# EAGLE schematic MAIN_V093r3 (EAGLE 5.11)

## Sheet 1 of 4
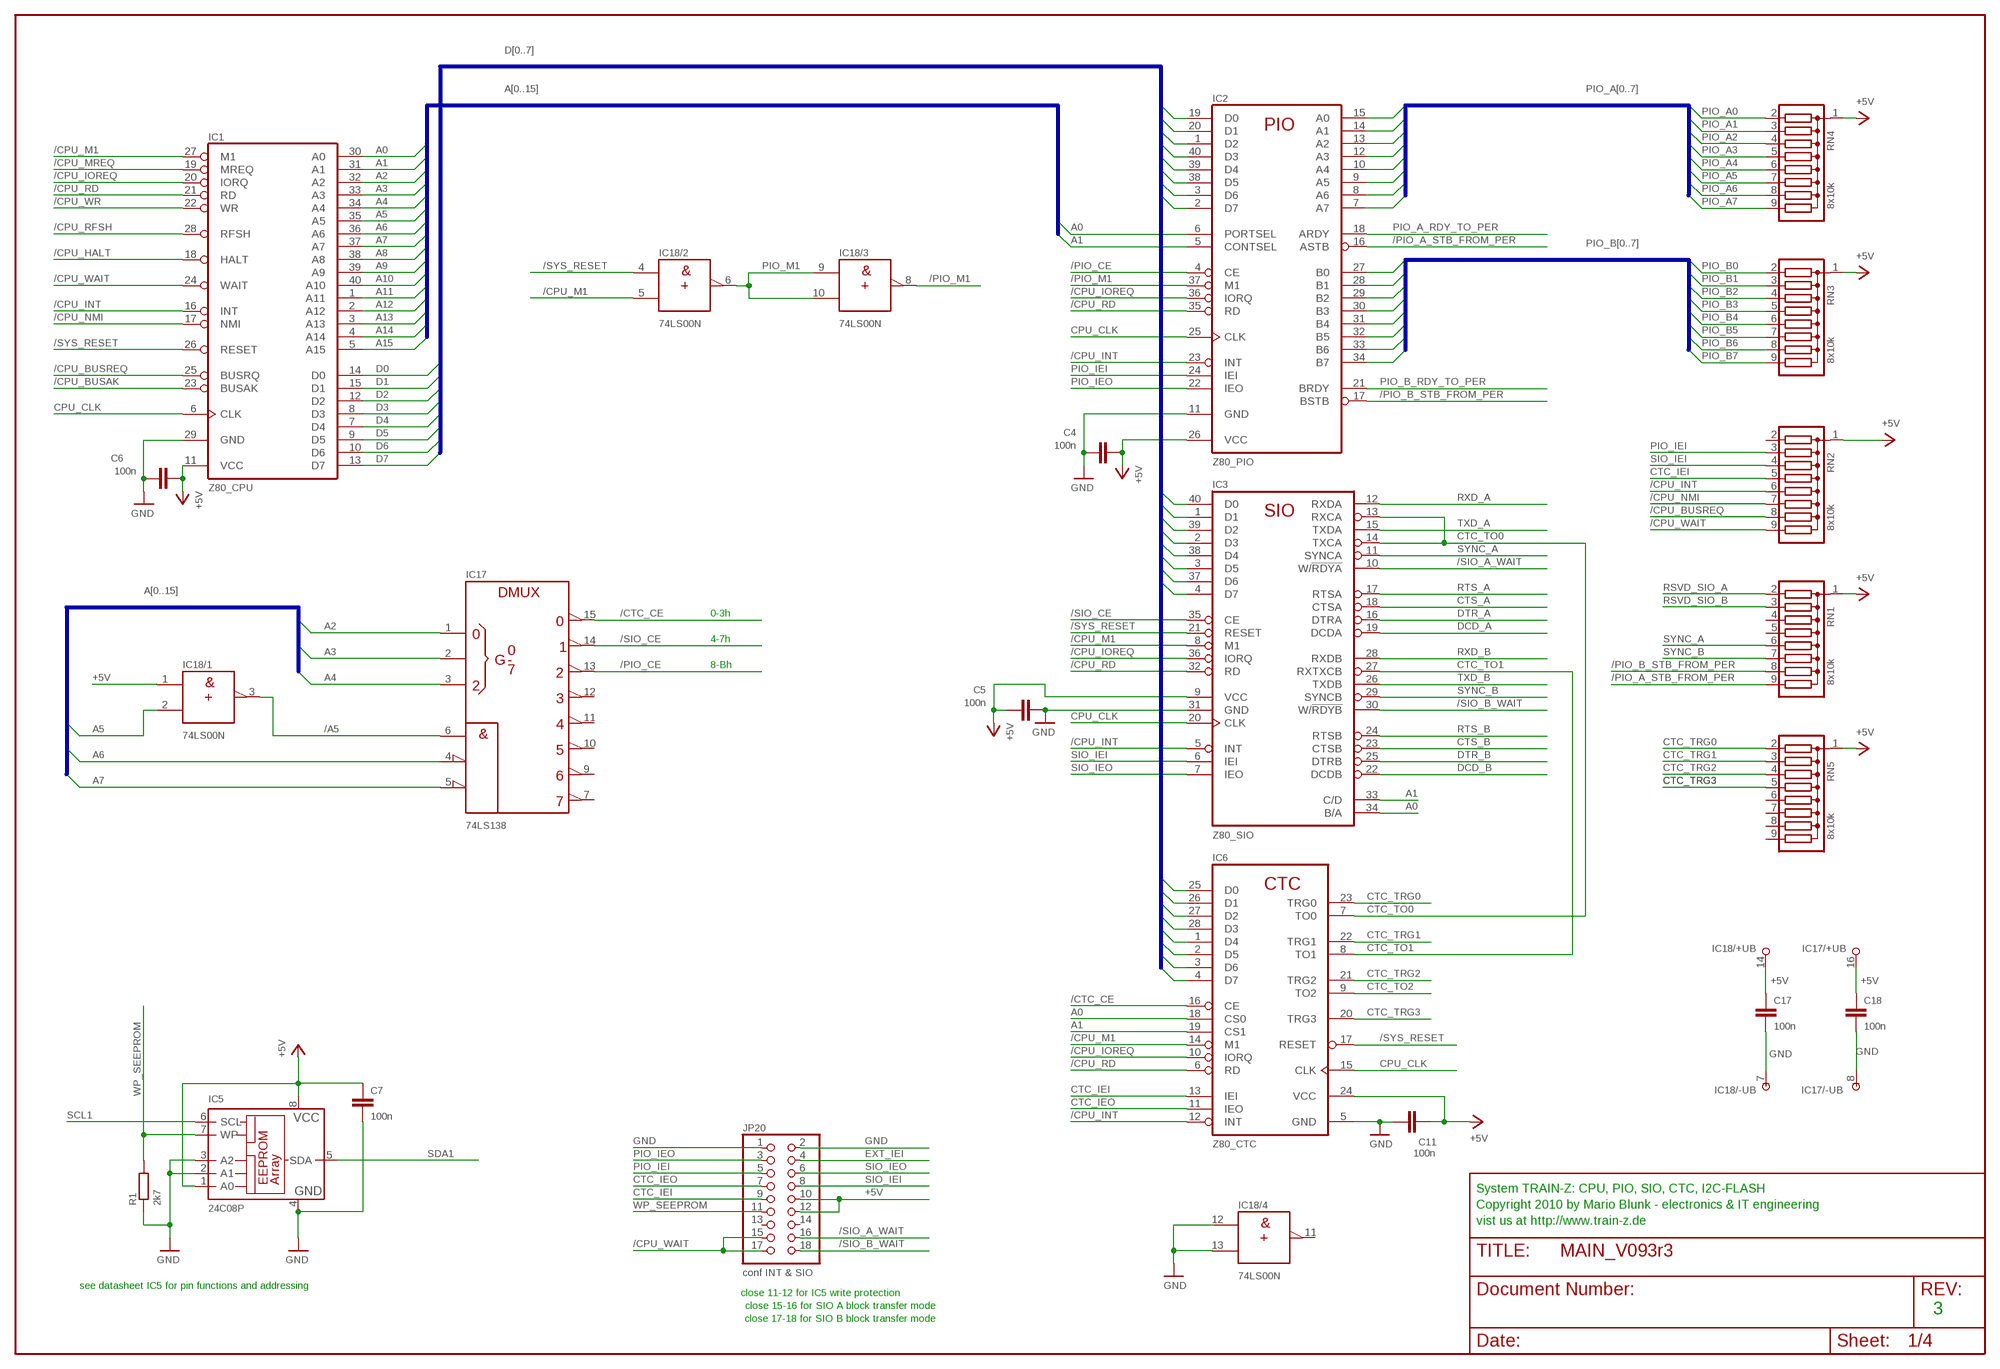
[diagram p0: schematic, sheet 1]

### Parts
C4  100n  C-EU050-030X075  [C050-030X075]
C5  100n  C-EU050-030X075  [C050-030X075]
C6  100n  C-EU050-030X075  [C050-030X075]
C7  100n  C-EU050-030X075  [C050-030X075]
C11  100n  C-EU050-030X075  [C050-030X075]
C17  100n  C-EU050-030X075  [C050-030X075]
C18  100n  C-EU050-030X075  [C050-030X075]
IC1  Z80_CPU  Z80CPU  [DIL40]
IC2  Z80_PIO  Z80PIO  [DIL40]
IC3  Z80_SIO  Z80SIO  [DIL40]
IC5  24C08P  24C64P  [DIL8]
IC6  Z80_CTC  Z80CTC  [DIL28]
IC17  74LS138  74138N  [DIL16]
IC18  74LS00N  [DIL14]
JP20  conf INT & SIO  PINHD-2X9  [2X09]
R1  2k7  R-EU_0207/10  [0207/10]
RN1  8x10k  G08R  [SIL9]
RN2  8x10k  G08R  [SIL9]
RN3  8x10k  G08R  [SIL9]
RN4  8x10k  G08R  [SIL9]
RN5  8x10k  G08R  [SIL9]

### Nets
+5V [+5V]: C4.2 C5.1 C6.2 C7.1 C11.1 C17.1 C18.1 IC1.11(VCC) IC2.26(VCC) IC3.9(VCC) IC5.1(A0) IC5.8(VCC) IC6.24(VCC) IC17.16(+UB) IC18.1(/1:A) IC18.14(/+UB:+UB) JP20.10 JP20.12 RN1.1 RN2.1 RN3.1 RN4.1 RN5.1 ; also sheet 2,3,4
/A5: IC17.6(G1) IC18.3(/1:Y)
/CPU_BUSAK: IC1.23(BUSAK) ; also sheet 2
/CPU_BUSREQ: IC1.25(BUSRQ) RN2.8 ; also sheet 2
/CPU_HALT: IC1.18(HALT) ; also sheet 2
/CPU_INT: IC1.16(INT) IC2.23(INT) IC3.5(INT) IC6.12(INT) RN2.6 ; also sheet 2
/CPU_IOREQ: IC1.20(IORQ) IC2.36(IORQ) IC3.36(IORQ) IC6.10(IORQ) ; also sheet 2
/CPU_M1: IC1.27(M1) IC3.8(M1) IC6.14(M1) IC18.5(/2:B) ; also sheet 2
/CPU_MREQ: IC1.19(MREQ) ; also sheet 2
/CPU_NMI: IC1.17(NMI) RN2.7 ; also sheet 2,4
/CPU_RD: IC1.21(RD) IC2.35(RD) IC3.32(RD) IC6.6(RD) ; also sheet 2
/CPU_RFSH: IC1.28(RFSH) ; also sheet 2
/CPU_WAIT: IC1.24(WAIT) JP20.15 JP20.17 RN2.9 ; also sheet 2
/CPU_WR: IC1.22(WR) ; also sheet 2
/CTC_CE: IC6.16(CE) IC17.15(Y0)
/PIO_A_STB_FROM_PER: IC2.16(ASTB) RN1.9 ; also sheet 2
/PIO_B_STB_FROM_PER: IC2.17(BSTB) RN1.8 ; also sheet 2
/PIO_CE: IC2.4(CE) IC17.13(Y2)
/PIO_M1: IC2.37(M1) IC18.8(/3:Y)
/SIO_A_WAIT: IC3.10(W/!RDYA) JP20.16
/SIO_B_WAIT: IC3.30(W/!RDYB) JP20.18
/SIO_CE: IC3.35(CE) IC17.14(Y1)
/SYS_RESET: IC1.26(RESET) IC3.21(RESET) IC6.17(RESET) IC18.4(/2:A) ; also sheet 2,4
A0: IC1.30(A0) IC2.6(PORTSEL) IC3.34(B/A) IC6.18(CS0) ; also sheet 2
A1: IC1.31(A1) IC2.5(CONTSEL) IC3.33(C/D) IC6.19(CS1) ; also sheet 2
A2: IC1.32(A2) IC17.1(A) ; also sheet 2
A3: IC1.33(A3) IC17.2(B) ; also sheet 2
A4: IC1.34(A4) IC17.3(C) ; also sheet 2
A5: IC1.35(A5) IC18.2(/1:B) ; also sheet 2
A6: IC1.36(A6) IC17.4(!G2A) ; also sheet 2
A7: IC1.37(A7) IC17.5(!G2B) ; also sheet 2
A8: IC1.38(A8) ; also sheet 2
A9: IC1.39(A9) ; also sheet 2
A10: IC1.40(A10) ; also sheet 2
A11: IC1.1(A11) ; also sheet 2
A12: IC1.2(A12) ; also sheet 2
A13: IC1.3(A13) ; also sheet 2
A14: IC1.4(A14) ; also sheet 2
A15: IC1.5(A15) ; also sheet 2
CPU_CLK: IC1.6(CLK) IC2.25(CLK) IC3.20(CLK) IC6.15(CLK) ; also sheet 2
CTC_IEI: IC6.13(IEI) JP20.9 RN2.5
CTC_IEO: IC6.11(IEO) JP20.7
CTC_TO0: IC3.13(RXCA) IC3.14(TXCA) IC6.7(TO0) ; also sheet 2
CTC_TO1: IC3.27(RXTXCB) IC6.8(TO1) ; also sheet 2
CTC_TO2: IC6.9(TO2) ; also sheet 2
CTC_TRG0: IC6.23(TRG0) RN5.2 ; also sheet 2
CTC_TRG1: IC6.22(TRG1) RN5.3 ; also sheet 2
CTC_TRG2: IC6.21(TRG2) RN5.4 ; also sheet 2
CTC_TRG3: IC6.20(TRG3) RN5.5 ; also sheet 2
CTS_A: IC3.18(CTSA) ; also sheet 3
CTS_B: IC3.23(CTSB) ; also sheet 3
D0: IC1.14(D0) IC2.19(D0) IC3.40(D0) IC6.25(D0) ; also sheet 2
D1: IC1.15(D1) IC2.20(D1) IC3.1(D1) IC6.26(D1) ; also sheet 2
D2: IC1.12(D2) IC2.1(D2) IC3.39(D2) IC6.27(D2) ; also sheet 2
D3: IC1.8(D3) IC2.40(D3) IC3.2(D3) IC6.28(D3) ; also sheet 2
D4: IC1.7(D4) IC2.39(D4) IC3.38(D4) IC6.1(D4) ; also sheet 2
D5: IC1.9(D5) IC2.38(D5) IC3.3(D5) IC6.2(D5) ; also sheet 2
D6: IC1.10(D6) IC2.3(D6) IC3.37(D6) IC6.3(D6) ; also sheet 2
D7: IC1.13(D7) IC2.2(D7) IC3.4(D7) IC6.4(D7) ; also sheet 2
DCD_A: IC3.19(DCDA) ; also sheet 3
DCD_B: IC3.22(DCDB) ; also sheet 3
DTR_A: IC3.16(DTRA) ; also sheet 3
DTR_B: IC3.25(DTRB) ; also sheet 3
EXT_IEI: JP20.4 ; also sheet 2
GND [GND]: C4.1 C5.2 C6.1 C7.2 C11.2 C17.2 C18.2 IC1.29(GND) IC2.11(GND) IC3.31(GND) IC5.2(A1) IC5.3(A2) IC5.4(GND) IC6.5(GND) IC17.8(-UB) IC18.7(/-UB:-UB) IC18.12(/4:A) IC18.13(/4:B) JP20.1 JP20.2 R1.1 ; also sheet 2,3,4
PIO_A0: IC2.15(A0) RN4.2 ; also sheet 2,4
PIO_A1: IC2.14(A1) RN4.3 ; also sheet 2,4
PIO_A2: IC2.13(A2) RN4.4 ; also sheet 2
PIO_A3: IC2.12(A3) RN4.5 ; also sheet 2
PIO_A4: IC2.10(A4) RN4.6 ; also sheet 2
PIO_A5: IC2.9(A5) RN4.7 ; also sheet 2
PIO_A6: IC2.8(A6) RN4.8 ; also sheet 2
PIO_A7: IC2.7(A7) RN4.9 ; also sheet 2
PIO_A_RDY_TO_PER: IC2.18(ARDY) ; also sheet 2
PIO_B0: IC2.27(B0) RN3.2 ; also sheet 4
PIO_B1: IC2.28(B1) RN3.3 ; also sheet 4
PIO_B2: IC2.29(B2) RN3.4 ; also sheet 2,4
PIO_B3: IC2.30(B3) RN3.5 ; also sheet 2,4
PIO_B4: IC2.31(B4) RN3.6 ; also sheet 2,3
PIO_B5: IC2.32(B5) RN3.7 ; also sheet 2,3
PIO_B6: IC2.33(B6) RN3.8 ; also sheet 2
PIO_B7: IC2.34(B7) RN3.9 ; also sheet 2
PIO_B_RDY_TO_PER: IC2.21(BRDY) ; also sheet 2
PIO_IEI: IC2.24(IEI) JP20.5 RN2.3
PIO_IEO: IC2.22(IEO) JP20.3
PIO_M1: IC18.6(/2:Y) IC18.9(/3:A) IC18.10(/3:B)
RSVD_SIO_A: RN1.2 ; also sheet 3
RSVD_SIO_B: RN1.3 ; also sheet 3
RTS_A: IC3.17(RTSA) ; also sheet 3
RTS_B: IC3.24(RTSB) ; also sheet 3
RXD_A: IC3.12(RXDA) ; also sheet 3
RXD_B: IC3.28(RXDB) ; also sheet 3
SCL1: IC5.6(SCL) ; also sheet 4
SDA1: IC5.5(SDA) ; also sheet 4
SIO_IEI: IC3.6(IEI) JP20.8 RN2.4
SIO_IEO: IC3.7(IEO) JP20.6
SYNC_A: IC3.11(SYNCA) RN1.6
SYNC_B: IC3.29(SYNCB) RN1.7
TXD_A: IC3.15(TXDA) ; also sheet 3
TXD_B: IC3.26(TXDB) ; also sheet 3
WP_SEEPROM: IC5.7(WP) JP20.11 R1.2
Unconnected: IC17.7(Y7) IC17.9(Y6) IC17.10(Y5) IC17.11(Y4) IC17.12(Y3) IC18.11(/4:Y) JP20.13 JP20.14 RN1.4 RN1.5 RN2.2 RN5.6 RN5.7 RN5.8 RN5.9

### Buses
A[0..15]
D[0..7]
PIO_B[0..7]
PIO_A[0..7]

### Notes on the sheet
- 0-3h
- 4-7h
- 8-Bh
- System TRAIN-Z: CPU, PIO, SIO, CTC, I2C-FLASH
- Copyright 2010 by Mario Blunk - electronics & IT engineering
- vist us at http://www.train-z.de
- see datasheet IC5 for pin functions and addressing | close 11-12 for IC5 write protection
- close 15-16 for SIO A block transfer mode
- close 17-18 for SIO B block transfer mode | 3

## Sheet 2 of 4
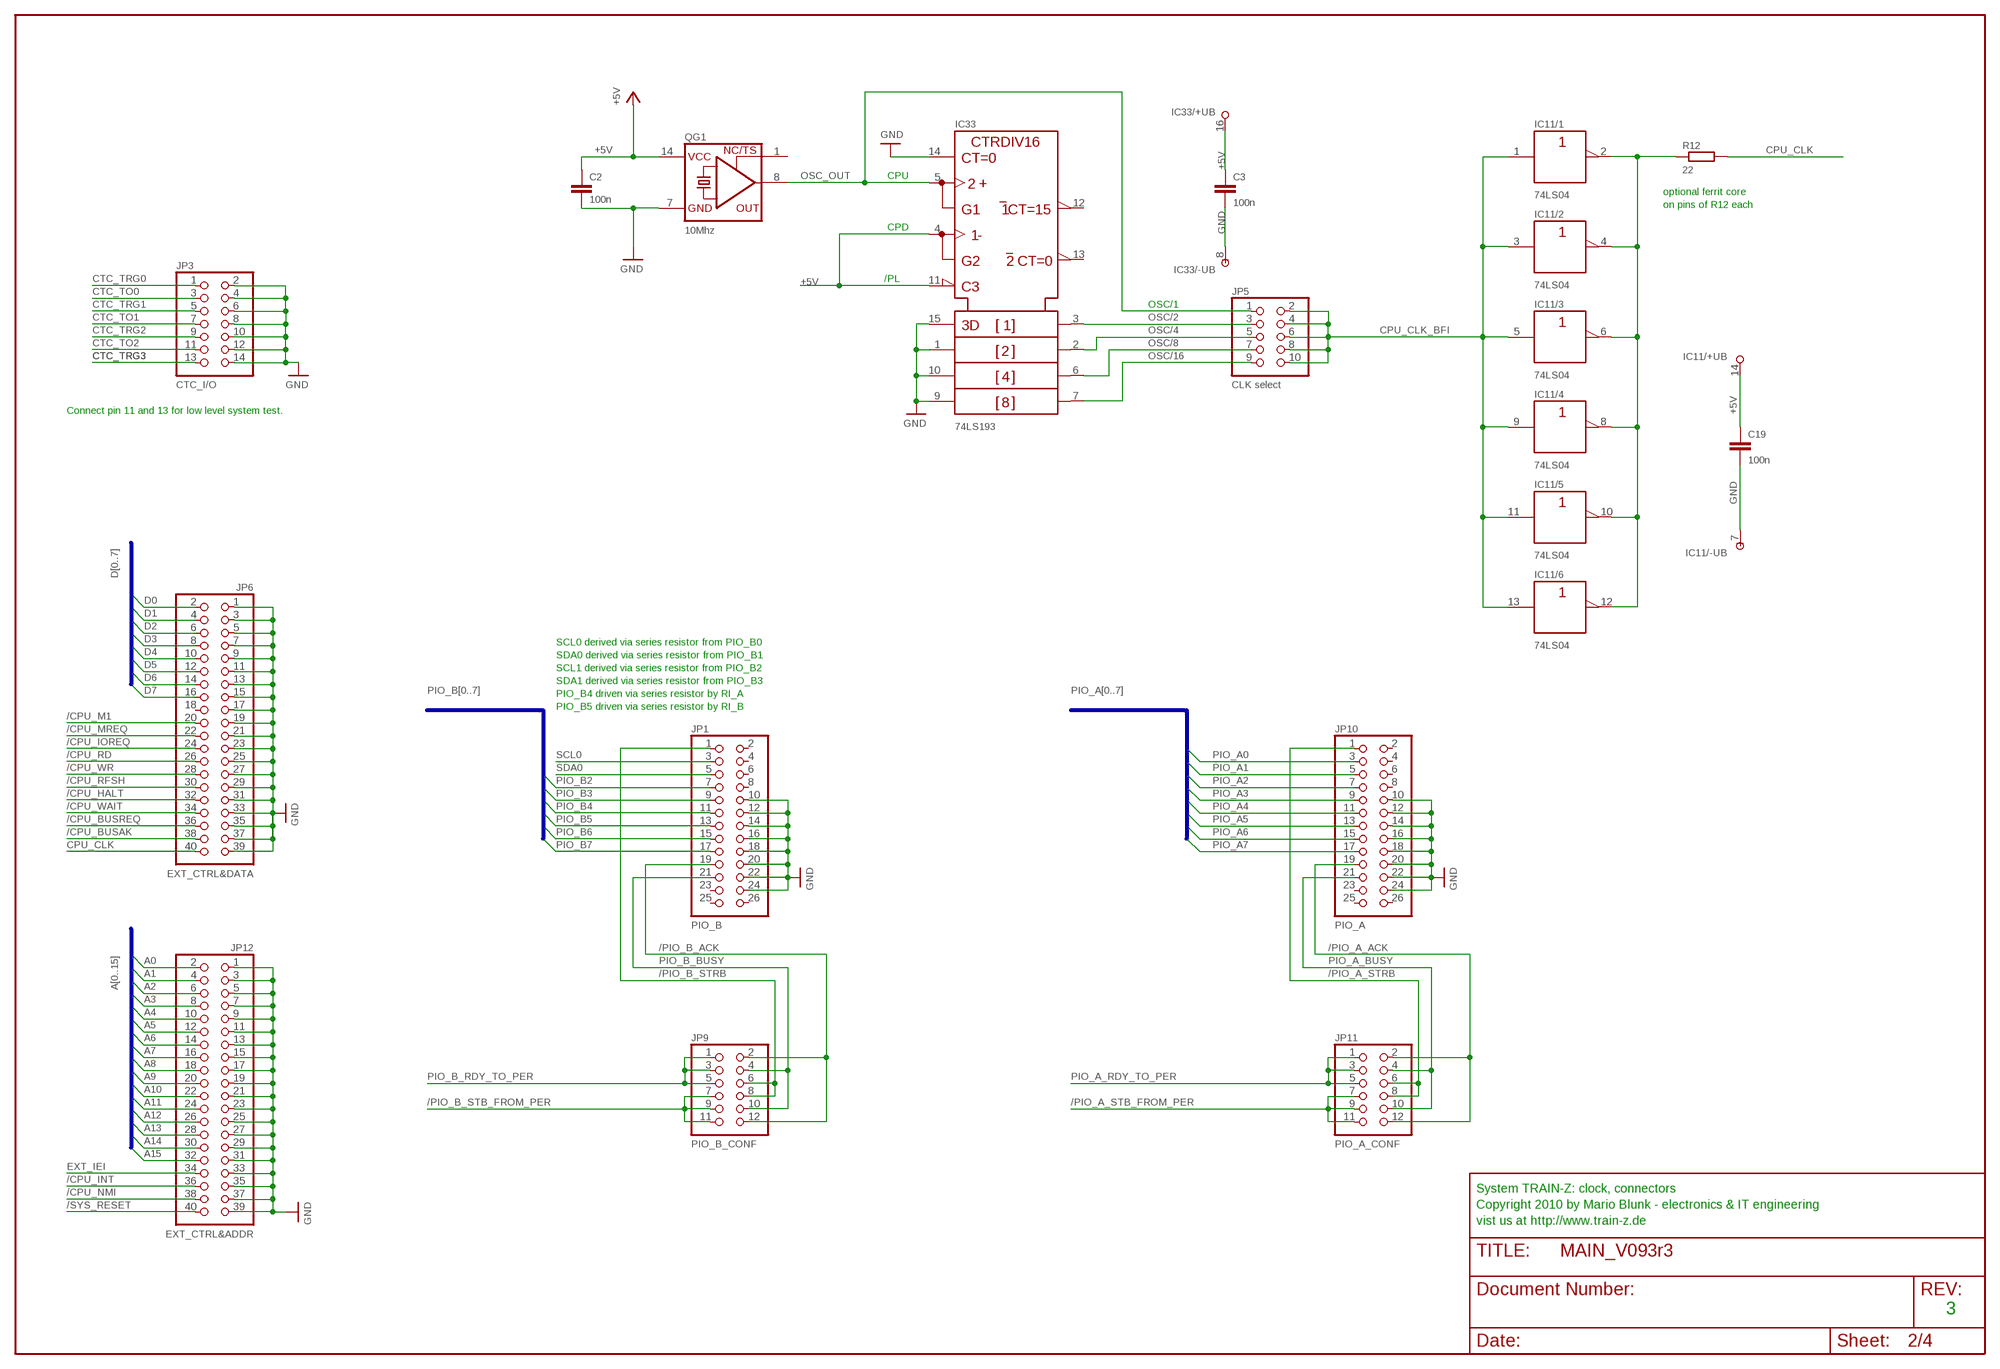
[diagram p1: schematic, sheet 2]

### Parts
C2  100n  C-EU050-025X075  [C050-025X075]
C3  100n  C-EU050-025X075  [C050-025X075]
C19  100n  C-EU050-025X075  [C050-025X075]
IC11  74LS04  7404N  [DIL14]
IC33  74LS193  74193N  [DIL16]
JP1  PIO_B  PINHD-2X13  [2X13]
JP3  CTC_I/O  PINHD-2X7  [2X07]
JP5  CLK select  PINHD-2X5  [2X05]
JP6  EXT_CTRL&DATA  PINHD-2X20  [2X20]
JP9  PIO_B_CONF  PINHD-2X6  [2X06]
JP10  PIO_A  PINHD-2X13  [2X13]
JP11  PIO_A_CONF  PINHD-2X6  [2X06]
JP12  EXT_CTRL&ADDR  PINHD-2X20  [2X20]
QG1  10Mhz  XO-14  [DIL14S]
R12  22  R-EU_0207/15  [0207/15]

### Nets
+5V [+5V]: C2.1 C3.1 C19.1 IC11.14(/+UB:+UB) IC33.4(DOWN) IC33.11(!LOAD) IC33.16(+UB) QG1.14(VCC) ; also sheet 1,3,4
/CPU_BUSAK: JP6.38 ; also sheet 1
/CPU_BUSREQ: JP6.36 ; also sheet 1
/CPU_HALT: JP6.32 ; also sheet 1
/CPU_INT: JP12.36 ; also sheet 1
/CPU_IOREQ: JP6.24 ; also sheet 1
/CPU_M1: JP6.20 ; also sheet 1
/CPU_MREQ: JP6.22 ; also sheet 1
/CPU_NMI: JP12.38 ; also sheet 1,4
/CPU_RD: JP6.26 ; also sheet 1
/CPU_RFSH: JP6.30 ; also sheet 1
/CPU_WAIT: JP6.34 ; also sheet 1
/CPU_WR: JP6.28 ; also sheet 1
/PIO_A_ACK: JP10.19 JP11.2 JP11.12
/PIO_A_STB_FROM_PER: JP11.7 JP11.9 JP11.11 ; also sheet 1
/PIO_A_STRB: JP10.1 JP11.6 JP11.8
/PIO_B_ACK: JP1.19 JP9.2 JP9.12
/PIO_B_STB_FROM_PER: JP9.7 JP9.9 JP9.11 ; also sheet 1
/PIO_B_STRB: JP1.1 JP9.6 JP9.8
/SYS_RESET: JP12.40 ; also sheet 1,4
A0: JP12.2 ; also sheet 1
A1: JP12.4 ; also sheet 1
A2: JP12.6 ; also sheet 1
A3: JP12.8 ; also sheet 1
A4: JP12.10 ; also sheet 1
A5: JP12.12 ; also sheet 1
A6: JP12.14 ; also sheet 1
A7: JP12.16 ; also sheet 1
A8: JP12.18 ; also sheet 1
A9: JP12.20 ; also sheet 1
A10: JP12.22 ; also sheet 1
A11: JP12.24 ; also sheet 1
A12: JP12.26 ; also sheet 1
A13: JP12.28 ; also sheet 1
A14: JP12.30 ; also sheet 1
A15: JP12.32 ; also sheet 1
CLK_DRV_OUT: IC11.2(/1:Y) IC11.4(/2:Y) IC11.6(/3:Y) IC11.8(/4:Y) IC11.10(/5:Y) IC11.12(/6:Y) R12.1
CPU_CLK: JP6.40 R12.2 ; also sheet 1
CPU_CLK_BFI: IC11.1(/1:A) IC11.3(/2:A) IC11.5(/3:A) IC11.9(/4:A) IC11.11(/5:A) IC11.13(/6:A) JP5.2 JP5.4 JP5.6 JP5.8 JP5.10
CTC_TO0: JP3.3 ; also sheet 1
CTC_TO1: JP3.7 ; also sheet 1
CTC_TO2: JP3.11 ; also sheet 1
CTC_TRG0: JP3.1 ; also sheet 1
CTC_TRG1: JP3.5 ; also sheet 1
CTC_TRG2: JP3.9 ; also sheet 1
CTC_TRG3: JP3.13 ; also sheet 1
D0: JP6.2 ; also sheet 1
D1: JP6.4 ; also sheet 1
D2: JP6.6 ; also sheet 1
D3: JP6.8 ; also sheet 1
D4: JP6.10 ; also sheet 1
D5: JP6.12 ; also sheet 1
D6: JP6.14 ; also sheet 1
D7: JP6.16 ; also sheet 1
EXT_IEI: JP12.34 ; also sheet 1
GND [GND]: C2.2 C3.2 C19.2 IC11.7(/-UB:-UB) IC33.1(B) IC33.8(-UB) IC33.9(D) IC33.10(C) IC33.14(CLR) IC33.15(A) JP1.10 JP1.12 JP1.14 JP1.16 JP1.18 JP1.20 JP1.22 JP1.24 JP3.2 JP3.4 JP3.6 JP3.8 JP3.10 JP3.12 JP3.14 JP6.1 JP6.3 JP6.5 JP6.7 JP6.9 JP6.11 JP6.13 JP6.15 JP6.17 JP6.19 JP6.21 JP6.23 JP6.25 JP6.27 JP6.29 JP6.31 JP6.33 JP6.35 JP6.37 JP6.39 JP10.10 JP10.12 JP10.14 JP10.16 JP10.18 JP10.20 JP10.22 JP10.24 JP12.1 JP12.3 JP12.5 JP12.7 JP12.9 JP12.11 JP12.13 JP12.15 JP12.17 JP12.19 JP12.21 JP12.23 JP12.25 JP12.27 JP12.29 JP12.31 JP12.33 JP12.35 JP12.37 JP12.39 QG1.7(GND) ; also sheet 1,3,4
OSC/2: IC33.3(QA) JP5.3
OSC/4: IC33.2(QB) JP5.5
OSC/8: IC33.6(QC) JP5.7
OSC/16: IC33.7(QD) JP5.9
OSC_OUT: IC33.5(UP) JP5.1 QG1.8(OUT)
PIO_A0: JP10.3 ; also sheet 1,4
PIO_A1: JP10.5 ; also sheet 1,4
PIO_A2: JP10.7 ; also sheet 1
PIO_A3: JP10.9 ; also sheet 1
PIO_A4: JP10.11 ; also sheet 1
PIO_A5: JP10.13 ; also sheet 1
PIO_A6: JP10.15 ; also sheet 1
PIO_A7: JP10.17 ; also sheet 1
PIO_A_BUSY: JP10.21 JP11.4 JP11.10
PIO_A_RDY_TO_PER: JP11.1 JP11.3 JP11.5 ; also sheet 1
PIO_B2: JP1.7 ; also sheet 1,4
PIO_B3: JP1.9 ; also sheet 1,4
PIO_B4: JP1.11 ; also sheet 1,3
PIO_B5: JP1.13 ; also sheet 1,3
PIO_B6: JP1.15 ; also sheet 1
PIO_B7: JP1.17 ; also sheet 1
PIO_B_BUSY: JP1.21 JP9.4 JP9.10
PIO_B_RDY_TO_PER: JP9.1 JP9.3 JP9.5 ; also sheet 1
SCL0: JP1.3 ; also sheet 4
SDA0: JP1.5 ; also sheet 4
Unconnected: IC33.12(!CO) IC33.13(!BO) JP1.2 JP1.4 JP1.6 JP1.8 JP1.23 JP1.25 JP1.26 JP6.18 JP10.2 JP10.4 JP10.6 JP10.8 JP10.23 JP10.25 JP10.26 QG1.1(TS)

### Buses
D[0..7]
A[0..15]
PIO_B[0..7]
PIO_A[0..7]

### Notes on the sheet
- CPU
- optional ferrit core
- on pins of R12 each
- CPD
- /PL
- OSC/1
- Connect pin 11 and 13 for low level system test.
- SCL0 derived via series resistor from PIO_B0
- SDA0 derived via series resistor from PIO_B1
- SCL1 derived via series resistor from PIO_B2
- SDA1 derived via series resistor from PIO_B3
- PIO_B4 driven via series resistor by RI_A
- PIO_B5 driven via series resistor by RI_B
- System TRAIN-Z: clock, connectors
- Copyright 2010 by Mario Blunk - electronics & IT engineering
- vist us at http://www.train-z.de
- 3

## Sheet 3 of 4
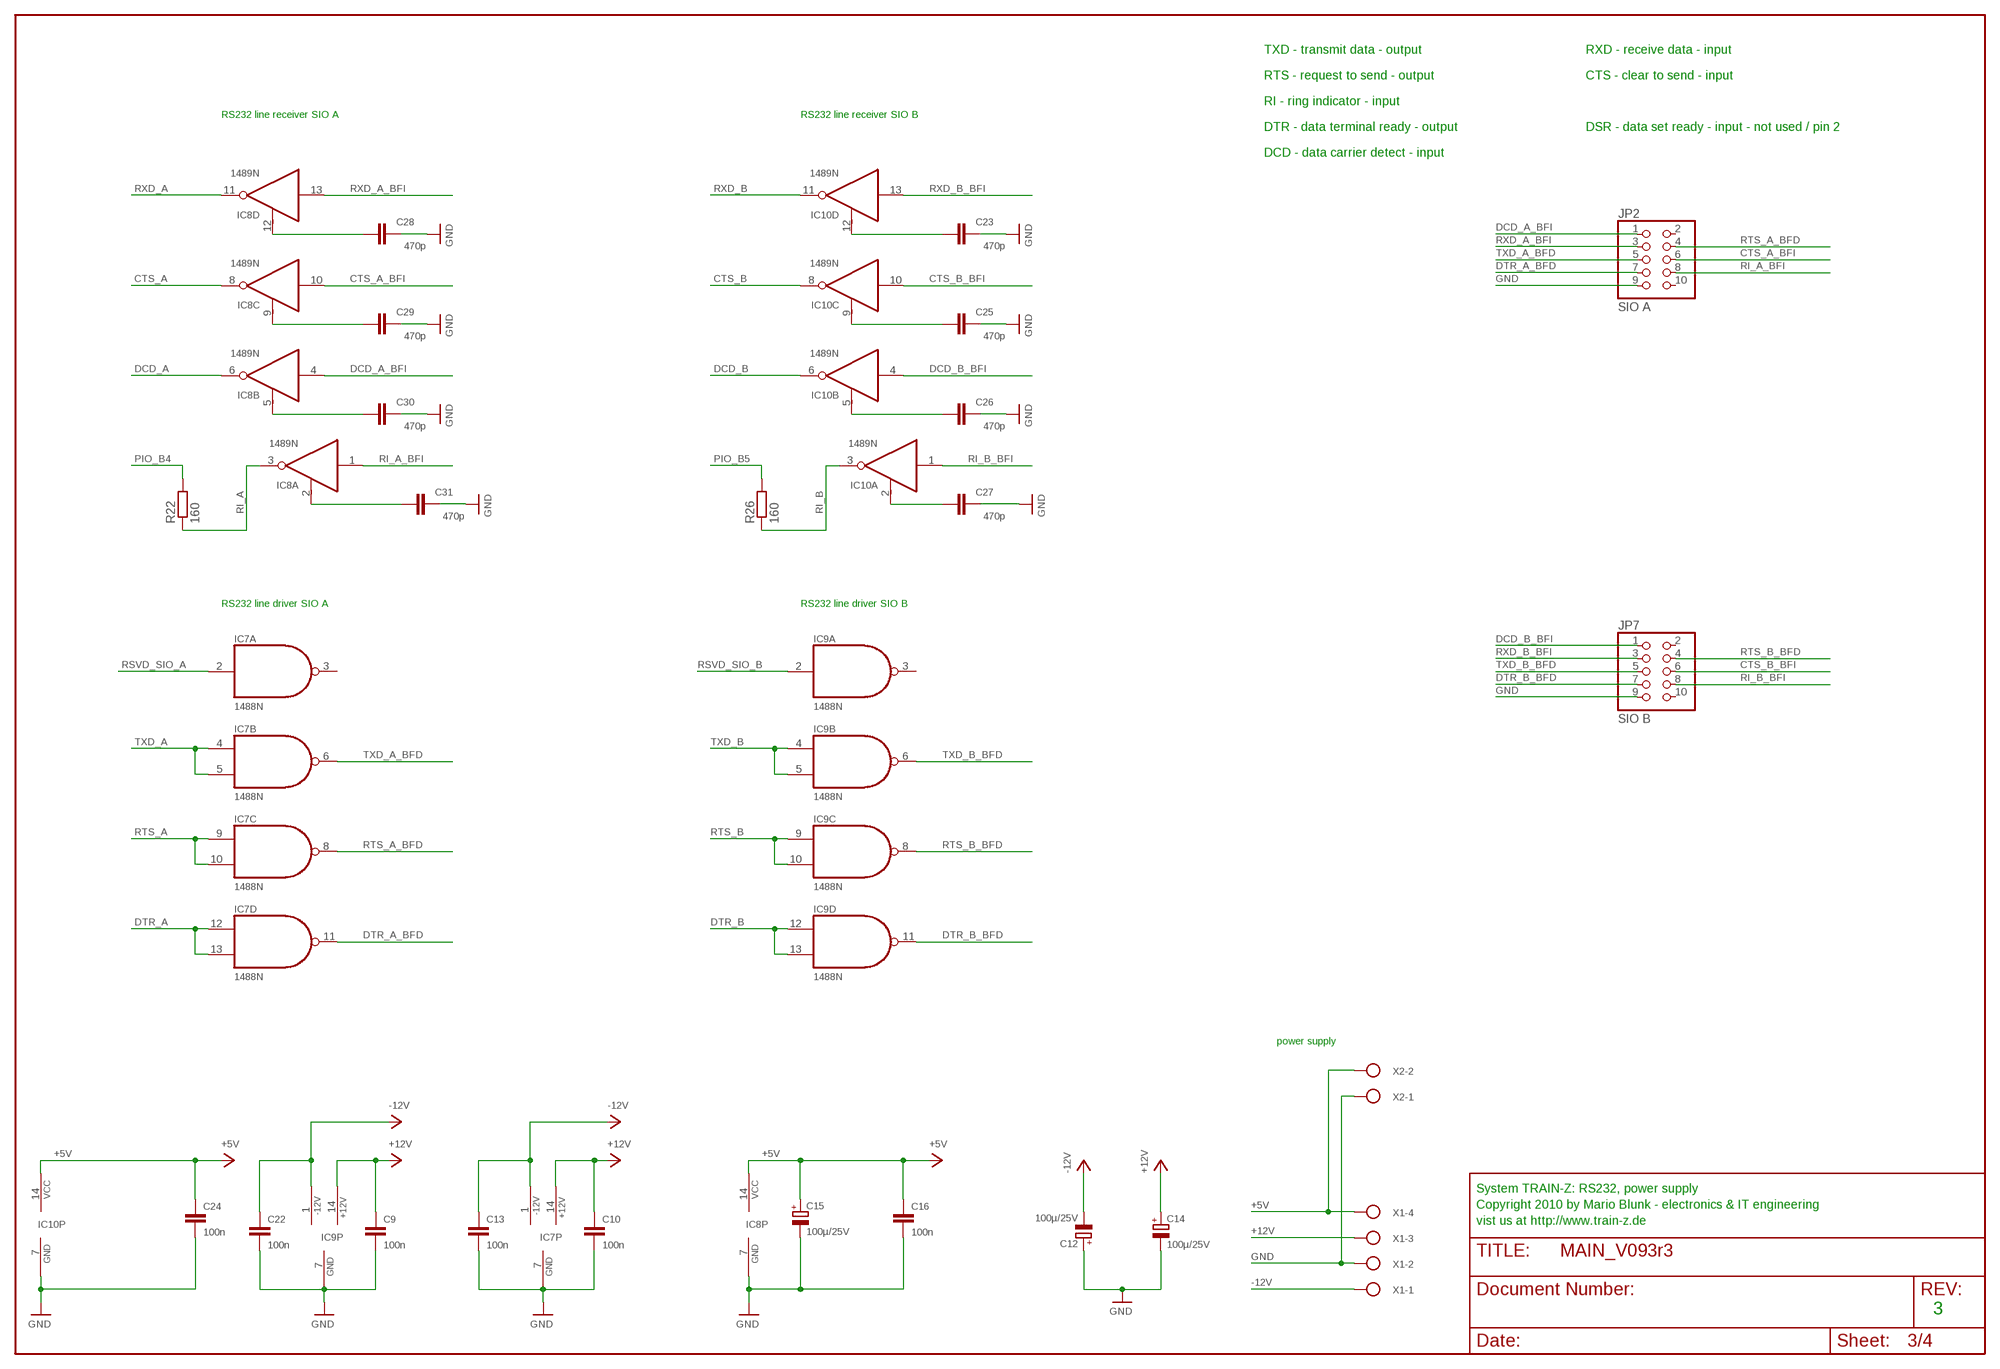
[diagram p2: schematic, sheet 3]

### Parts
C9  100n  C-EU050-030X075  [C050-030X075]
C10  100n  C-EU050-030X075  [C050-030X075]
C12  100µ/25V  CPOL-EUE2.5-7  [E2,5-7]
C13  100n  C-EU050-030X075  [C050-030X075]
C14  100µ/25V  CPOL-EUE2.5-7  [E2,5-7]
C15  100µ/25V  CPOL-EUE2.5-7  [E2,5-7]
C16  100n  C-EU050-030X075  [C050-030X075]
C22  100n  C-EU050-030X075  [C050-030X075]
C23  470p  C-EU050-030X075  [C050-030X075]
C24  100n  C-EU050-030X075  [C050-030X075]
C25  470p  C-EU050-030X075  [C050-030X075]
C26  470p  C-EU050-030X075  [C050-030X075]
C27  470p  C-EU050-030X075  [C050-030X075]
C28  470p  C-EU050-030X075  [C050-030X075]
C29  470p  C-EU050-030X075  [C050-030X075]
C30  470p  C-EU050-030X075  [C050-030X075]
C31  470p  C-EU050-030X075  [C050-030X075]
IC7  1488N  [DIL14]
IC8  1489N  [DIL14]
IC9  1488N  [DIL14]
IC10  1489N  [DIL14]
JP2  SIO A  PINHD-2X5  [2X05]
JP7  SIO B  PINHD-2X5  [2X05]
R22  160  R-EU_0207/10  [0207/10]
R26  160  R-EU_0207/10  [0207/10]
X1  W237-4  [W237-4]
X2  W237-102  [W237-102]

### Nets
+5V [+5V]: C15.+ C16.1 C24.1 IC8.14(P:VCC) IC10.14(P:VCC) X1.4 X2.2 ; also sheet 1,2,4
+12V [+12V]: C9.1 C10.1 C14.+ IC7.14(P:+12V) IC9.14(P:+12V) X1.3 ; also sheet 4
-12V [-12V]: C12.- C13.1 C22.1 IC7.1(P:-12V) IC9.1(P:-12V) X1.1 ; also sheet 4
CTS_A: IC8.8(C:O) ; also sheet 1
CTS_A_BFI: IC8.10(C:I) JP2.6
CTS_B: IC10.8(C:O) ; also sheet 1
CTS_B_BFI: IC10.10(C:I) JP7.6
DCD_A: IC8.6(B:O) ; also sheet 1
DCD_A_BFI: IC8.4(B:I) JP2.1
DCD_B: IC10.6(B:O) ; also sheet 1
DCD_B_BFI: IC10.4(B:I) JP7.1
DTR_A: IC7.12(D:I0) IC7.13(D:I1) ; also sheet 1
DTR_A_BFD: IC7.11(D:O) JP2.7
DTR_B: IC9.12(D:I0) IC9.13(D:I1) ; also sheet 1
DTR_B_BFD: IC9.11(D:O) JP7.7
GND [GND]: C9.2 C10.2 C12.+ C13.2 C14.- C15.- C16.2 C22.2 C23.2 C24.2 C25.2 C26.2 C27.2 C28.2 C29.2 C30.2 C31.2 IC7.7(P:GND) IC8.7(P:GND) IC9.7(P:GND) IC10.7(P:GND) JP2.9 JP7.9 X1.2 X2.1 ; also sheet 1,2,4
PIO_B4: R22.2 ; also sheet 1,2
PIO_B5: R26.2 ; also sheet 1,2
RC_CTS_A: C29.1 IC8.9(C:RC)
RC_CTS_B: C25.1 IC10.9(C:RC)
RC_DCD_A: C30.1 IC8.5(B:RC)
RC_DCD_B: C26.1 IC10.5(B:RC)
RC_RI_A: C31.1 IC8.2(A:RC)
RC_RI_B: C27.1 IC10.2(A:RC)
RC_RXD_A: C28.1 IC8.12(D:RC)
RC_RXD_B: C23.1 IC10.12(D:RC)
RI_A: IC8.3(A:O) R22.1
RI_A_BFI: IC8.1(A:I) JP2.8
RI_B: IC10.3(A:O) R26.1
RI_B_BFI: IC10.1(A:I) JP7.8
RSVD_SIO_A: IC7.2(A:I) ; also sheet 1
RSVD_SIO_B: IC9.2(A:I) ; also sheet 1
RTS_A: IC7.9(C:I0) IC7.10(C:I1) ; also sheet 1
RTS_A_BFD: IC7.8(C:O) JP2.4
RTS_B: IC9.9(C:I0) IC9.10(C:I1) ; also sheet 1
RTS_B_BFD: IC9.8(C:O) JP7.4
RXD_A: IC8.11(D:O) ; also sheet 1
RXD_A_BFI: IC8.13(D:I) JP2.3
RXD_B: IC10.11(D:O) ; also sheet 1
RXD_B_BFI: IC10.13(D:I) JP7.3
TXD_A: IC7.4(B:I0) IC7.5(B:I1) ; also sheet 1
TXD_A_BFD: IC7.6(B:O) JP2.5
TXD_B: IC9.4(B:I0) IC9.5(B:I1) ; also sheet 1
TXD_B_BFD: IC9.6(B:O) JP7.5
Unconnected: IC7.3(A:O) IC9.3(A:O) JP2.2 JP2.10 JP7.2 JP7.10

### Notes on the sheet
- TXD - transmit data - output | RXD - receive data - input
- RTS - request to send - output | CTS - clear to send - input
- RI - ring indicator - input
- RS232 line receiver SIO A | RS232 line receiver SIO B
- DTR - data terminal ready - output | DSR - data set ready - input - not used / pin 2
- DCD - data carrier detect - input
- RS232 line driver SIO A | RS232 line driver SIO B
- power supply
- System TRAIN-Z: RS232, power supply
- Copyright 2010 by Mario Blunk - electronics & IT engineering
- vist us at http://www.train-z.de
- 3

## Sheet 4 of 4
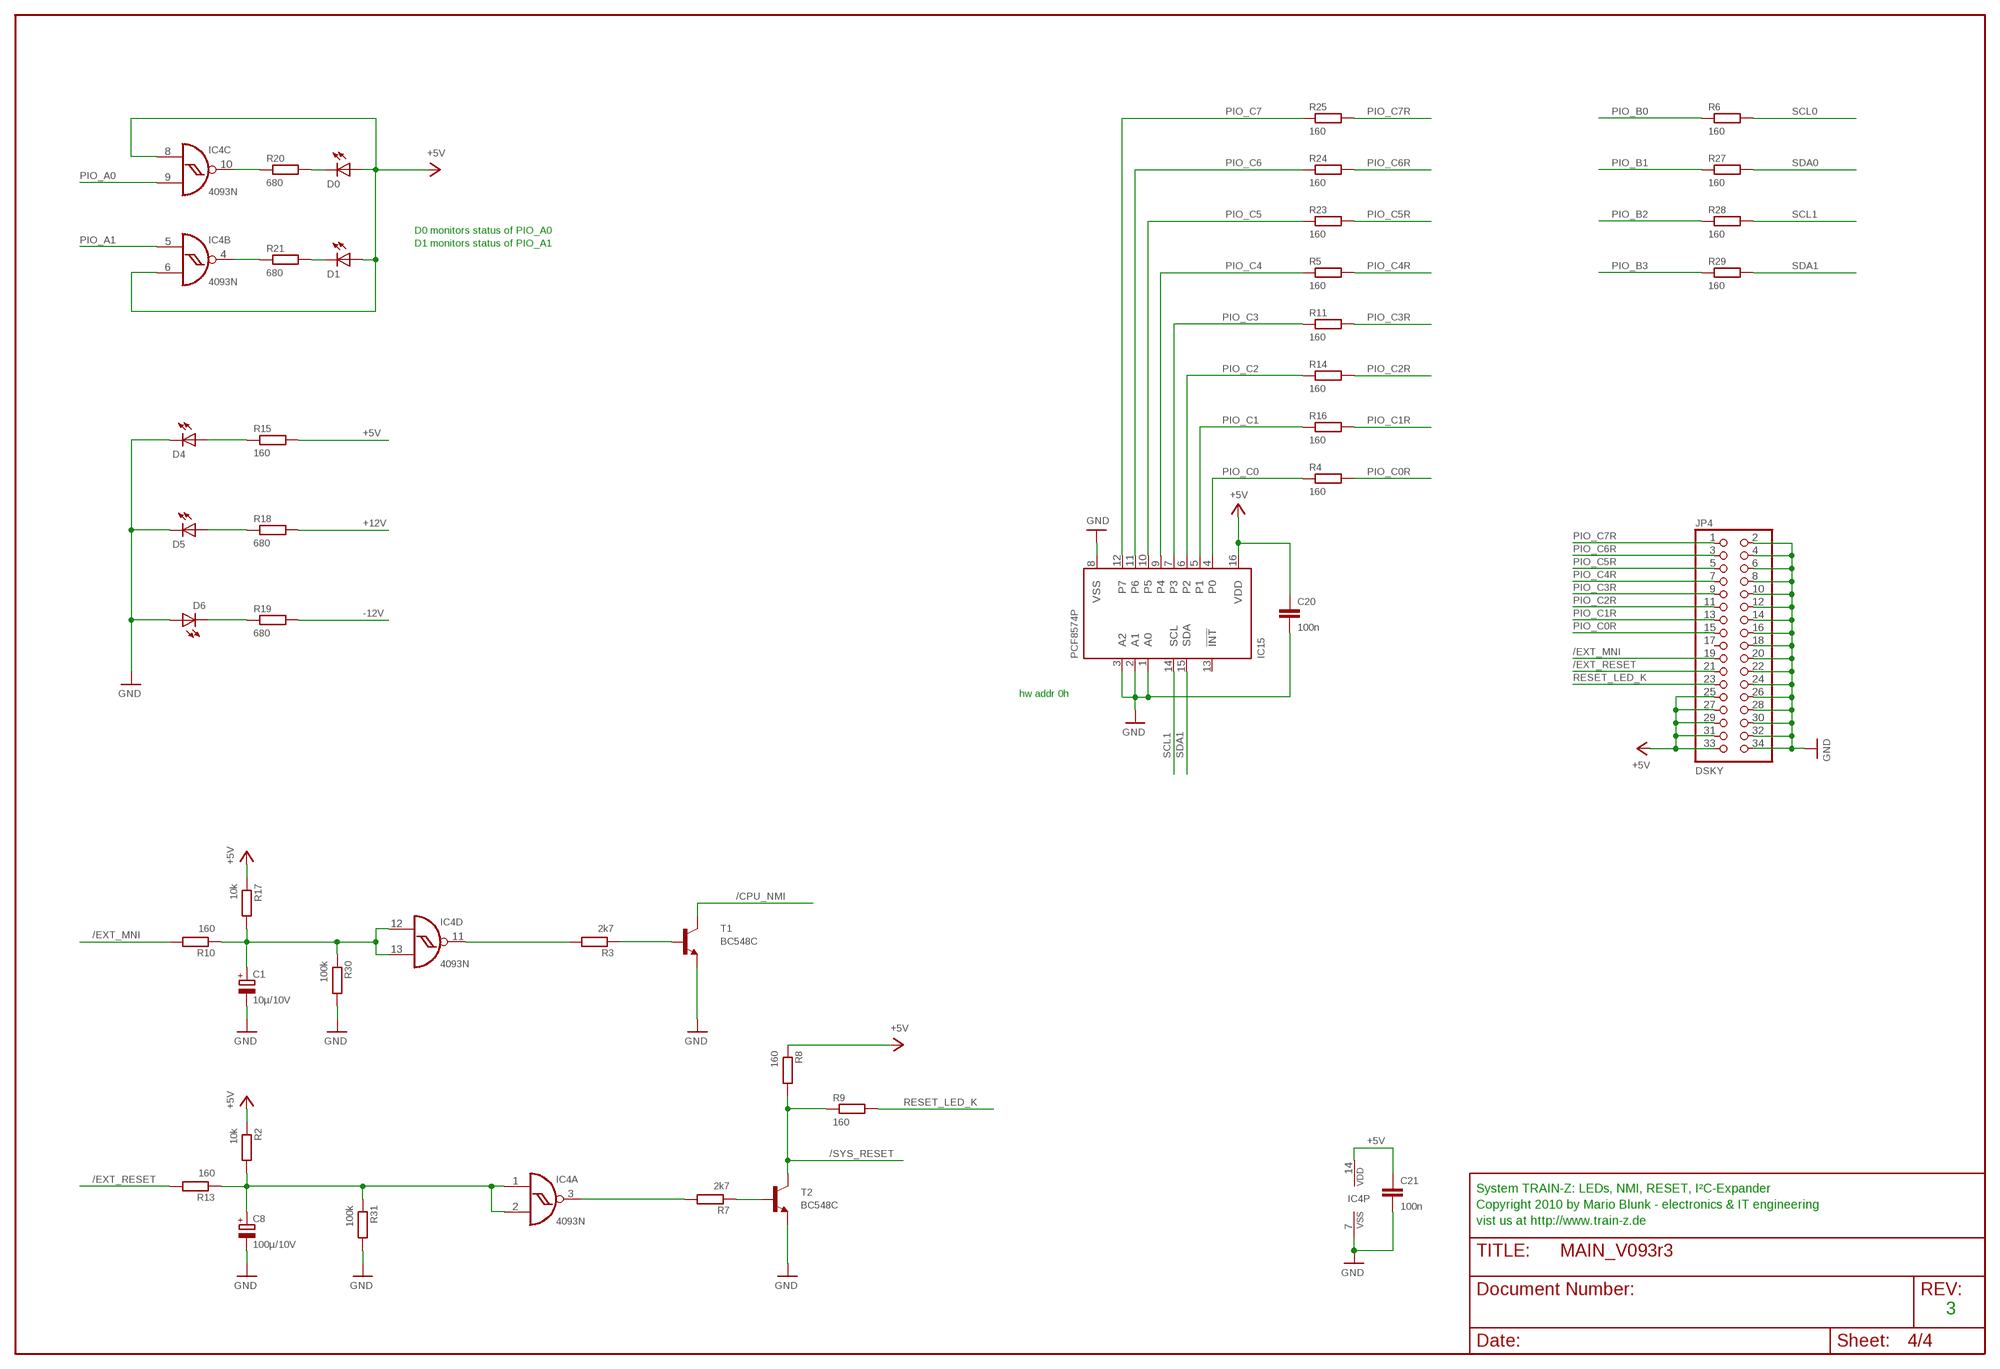
[diagram p3: schematic, sheet 4]

### Parts
C1  10µ/10V  CPOL-EUE2.5-7  [E2,5-7]
C8  100µ/10V  CPOL-EUE2.5-7  [E2,5-7]
C20  100n  C-EU050-025X075  [C050-025X075]
C21  100n  C-EU050-025X075  [C050-025X075]
D0  LED3MM  [LED3MM]
D1  LED3MM  [LED3MM]
D4  LED3MM  [LED3MM]
D5  LED3MM  [LED3MM]
D6  LED3MM  [LED3MM]
IC4  4093N  [DIL14]
IC15  PCF8574P  [DIL16]
JP4  DSKY  PINHD-2X17  [2X17]
R2  10k  R-EU_0207/10  [0207/10]
R3  2k7  R-EU_0207/10  [0207/10]
R4  160  R-EU_0207/10  [0207/10]
R5  160  R-EU_0207/10  [0207/10]
R6  160  R-EU_0207/10  [0207/10]
R7  2k7  R-EU_0207/10  [0207/10]
R8  160  R-EU_0207/10  [0207/10]
R9  160  R-EU_0207/10  [0207/10]
R10  160  R-EU_0207/10  [0207/10]
R11  160  R-EU_0207/10  [0207/10]
R13  160  R-EU_0207/10  [0207/10]
R14  160  R-EU_0207/10  [0207/10]
R15  160  R-EU_0207/10  [0207/10]
R16  160  R-EU_0207/10  [0207/10]
R17  10k  R-EU_0207/10  [0207/10]
R18  680  R-EU_0207/10  [0207/10]
R19  680  R-EU_0207/10  [0207/10]
R20  680  R-EU_0207/10  [0207/10]
R21  680  R-EU_0207/10  [0207/10]
R23  160  R-EU_0207/10  [0207/10]
R24  160  R-EU_0207/10  [0207/10]
R25  160  R-EU_0207/10  [0207/10]
R27  160  R-EU_0207/10  [0207/10]
R28  160  R-EU_0207/10  [0207/10]
R29  160  R-EU_0207/10  [0207/10]
R30  100k  R-EU_0207/10  [0207/10]
R31  100k  R-EU_0207/10  [0207/10]
T1  BC548C  BC547  [TO92]
T2  BC548C  BC547  [TO92]

### Nets
+5V [+5V]: C20.1 C21.1 D0.A D1.A IC4.6(B:I1) IC4.8(C:I0) IC4.14(P:VDD) IC15.16(VDD) JP4.25 JP4.27 JP4.29 JP4.31 JP4.33 R2.1 R8.1 R15.2 R17.1 ; also sheet 1,2,3
+12V [+12V]: R18.2 ; also sheet 3
-12V [-12V]: R19.2 ; also sheet 3
/CPU_NMI: T1.3(C) ; also sheet 1,2
/EXT_MNI: JP4.19 R10.2
/EXT_RESET: JP4.21 R13.2
/SYS_RESET: R8.2 R9.1 T2.3(C) ; also sheet 1,2
D0K: D0.K(C) R20.2
D1K: D1.K(C) R21.2
D4A: D4.A R15.1
D5A: D5.A R18.1
D6A: D6.K(C) R19.1
GND [GND]: C1.- C8.- C20.2 C21.2 D4.K(C) D5.K(C) D6.A IC4.7(P:VSS) IC15.1(A0) IC15.2(A1) IC15.3(A2) IC15.8(VSS) JP4.2 JP4.4 JP4.6 JP4.8 JP4.10 JP4.12 JP4.14 JP4.16 JP4.18 JP4.20 JP4.22 JP4.24 JP4.26 JP4.28 JP4.30 JP4.32 JP4.34 R30.2 R31.2 T1.1(E) T2.1(E) ; also sheet 1,2,3
IC4A_IN1: C8.+ IC4.1(A:I0) IC4.2(A:I1) R2.2 R13.1 R31.1
IC4A_OUT: IC4.3(A:O) R7.2
IC4BO: IC4.4(B:O) R21.1
IC4CO: IC4.10(C:O) R20.1
IC4D_IN12: C1.+ IC4.12(D:I0) IC4.13(D:I1) R10.1 R17.2 R30.1
NMI_BFD: IC4.11(D:O) R3.2
PIO_A0: IC4.9(C:I1) ; also sheet 1,2
PIO_A1: IC4.5(B:I0) ; also sheet 1,2
PIO_B0: R6.1 ; also sheet 1
PIO_B1: R27.1 ; also sheet 1
PIO_B2: R28.1 ; also sheet 1,2
PIO_B3: R29.1 ; also sheet 1,2
PIO_C0: IC15.4(P0) R4.1
PIO_C0R: JP4.15 R4.2
PIO_C1: IC15.5(P1) R16.1
PIO_C1R: JP4.13 R16.2
PIO_C2: IC15.6(P2) R14.1
PIO_C2R: JP4.11 R14.2
PIO_C3: IC15.7(P3) R11.1
PIO_C3R: JP4.9 R11.2
PIO_C4: IC15.9(P4) R5.1
PIO_C4R: JP4.7 R5.2
PIO_C5: IC15.10(P5) R23.1
PIO_C5R: JP4.5 R23.2
PIO_C6: IC15.11(P6) R24.1
PIO_C6R: JP4.3 R24.2
PIO_C7: IC15.12(P7) R25.1
PIO_C7R: JP4.1 R25.2
RESET_LED_K: JP4.23 R9.2
SCL0: R6.2 ; also sheet 2
SCL1: IC15.14(SCL) R28.2 ; also sheet 1
SDA0: R27.2 ; also sheet 2
SDA1: IC15.15(SDA) R29.2 ; also sheet 1
T1_B: R3.1 T1.2(B)
T2_B: R7.1 T2.2(B)
Unconnected: IC15.13(!INT) JP4.17

### Notes on the sheet
- D0 monitors status of PIO_A0
- D1 monitors status of PIO_A1
- hw addr 0h
- System TRAIN-Z: LEDs, NMI, RESET, I²C-Expander
- Copyright 2010 by Mario Blunk - electronics & IT engineering
- vist us at http://www.train-z.de
- 3

## Library data of the parts
C1 C8 C12 C14 C15 = rcl:CPOL-EU: POLARIZED CAPACITOR, European symbol
C2-C7 C9-C11 C13 C16-C31 = rcl:C-EU: CAPACITOR, European symbol
D0 D1 D4-D6 = led:LED: LED OSRAM: - CHIPLED LG R971, LG N971, LY N971, LG Q971, LY Q971, LO R971, LY R971 LH N974, LH R974 LS Q976, LO Q976, LY Q976 LO Q996 - Hyper CHIPLED LW Q18S LB Q993, LB Q99A, LB R99A - SideLED LS A670, LO A670, LY A670, LG A670, LP A670 LB A673, LV A673, LT A673, LW A673 LH A674 LY A675 LS A676, LA A676, LO A676, LY A676, LW A676 LS A679, LY A679, LG A679 - Hyper Micro SIDELED® LS Y876, LA Y876, LO Y876, LY Y876 LT Y87S - SmartLED LW L88C, LW L88S LB L89C, LB L89S, LG L890 LS L89K, LO L89K, LY L89K LS L896, LA L896, LO L896, LY L896 - TOPLED LS T670, LO T670, LY T670, LG T670, LP T670 LSG T670, LSP T670, LSY T670, LOP T670, LYG T670 LG T671, LOG T671, LSG T671 LB T673, LV T673, LT T673, LW T673 LH T674 LS T676, LA T676, LO T676, LY T676, LB T676, LH T676, LSB T676, LW T676 LB T67C, LV T67C, LT T67C, LS T67K, LO T67K, LY T67K, LW E67C LS E67B, LA E67B, LO E67B, LY E67B, LB E67C, LV E67C, LT E67C LW T67C LS T679, LY T679, LG T679 LS T770, LO T770, LY T770, LG T770, LP T770 LB T773, LV T773, LT T773, LW T773 LH T774 LS E675, LA E675, LY E675, LS T675 LS T776, LA T776, LO T776, LY T776, LB T776 LHGB T686 LT T68C, LB T68C - Hyper Mini TOPLED® LB M676 - Mini TOPLED Santana® LG M470 LS M47K, LO M47K, LY M47K Source: http://www.osram.convergy.de/
IC1 = zilog:Z80CPU: Z80 FAMILY DEVICE
IC2 = zilog:Z80PIO: Z80 FAMILY DEVICE
IC3 = zilog:Z80SIO: Z80 FAMILY DEVICE
IC4 = 40xx:4093: Quad 2-input NAND schmitt trigger
IC5 = microchip:24*: Serial EEPROM I2C
IC6 = zilog:Z80CTC: Z80 FAMILY DEVICE
IC7 IC9 = interface:14*88: Quad 2-input NAND gate
IC8 IC10 = interface:14*89: Quad line receivers BUFFER,
IC11 = 74ttl-din:74*04: Hex INVERTER
IC15 = micro-philips:PCF8574: I2C-Bus I/O DEVICE
IC17 = 74ttl-din:74*138: 3-line to 8-line DECODER/DEMULTIPLEXER
IC18 = 74ttl-din:74*00: Quad 2-input NAND gate
IC33 = 74ttl-din:74*193: Synchronus 4-bit up down COUNTER
JP1 JP10 = pinhead:PINHD-2X13: PIN HEADER
JP2 JP5 JP7 = pinhead:PINHD-2X5: PIN HEADER
JP3 = pinhead:PINHD-2X7: PIN HEADER
JP4 = pinhead:PINHD-2X17: PIN HEADER
JP6 JP12 = pinhead:PINHD-2X20: PIN HEADER
JP9 JP11 = pinhead:PINHD-2X6: PIN HEADER
JP20 = pinhead:PINHD-2X9: PIN HEADER
QG1 = crystal:XO-: CRYSTAL
R1-R31 = rcl:R-EU_: RESISTOR, European symbol
RN1-RN5 = resistor-sil:G08R: SIL RESISTOR
T1 T2 = transistor:BC547: NPN TRANSISTOR
X1 = con-wago-500:W237-4: WAGO SCREW CLAMP
X2 = con-wago-500:W237-102: WAGO SCREW CLAMP

## Net classes
0 default: width 0.254 mm, clearance 0.203 mm
1 +5V: width 1.016 mm, clearance 0.203 mm
2 +12V: width 1.016 mm, clearance 0.203 mm
3 -12V: width 1.016 mm, clearance 0.203 mm
4 GND: width 1.27 mm, clearance 0.203 mm